# EAGLE design test_usb_hub (EAGLE 6.1)
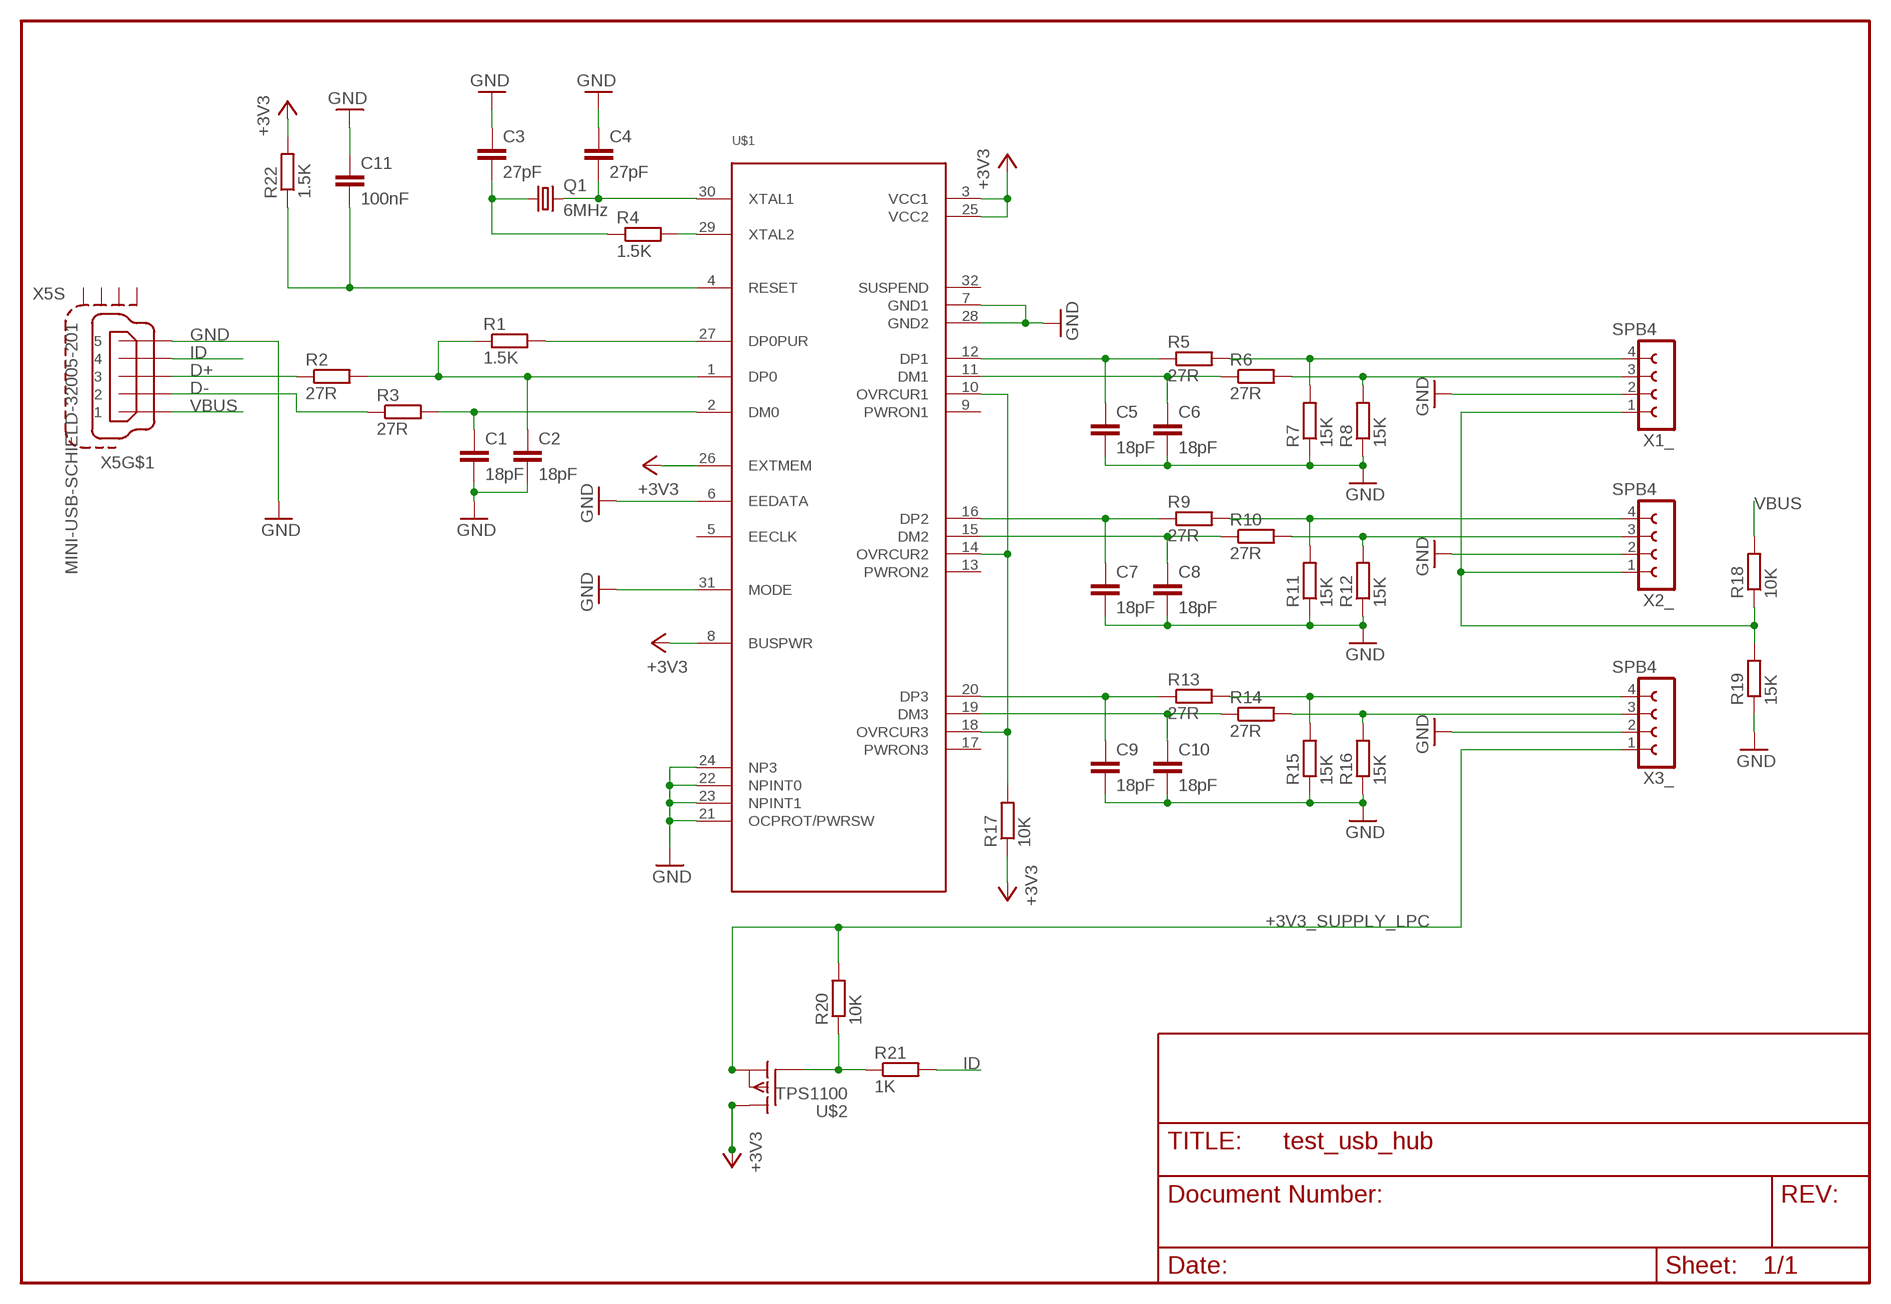
[diagram p0: schematic, sheet 1]

## Parts
C1  18pF  C-EUC1206  [C1206]
C2  18pF  C-EUC1206  [C1206]
C3  27pF  C-EUC1206  [C1206]
C4  27pF  C-EUC1206  [C1206]
C5  18pF  C-EUC1206  [C1206]
C6  18pF  C-EUC1206  [C1206]
C7  18pF  C-EUC1206  [C1206]
C8  18pF  C-EUC1206  [C1206]
C9  18pF  C-EUC1206  [C1206]
C10  18pF  C-EUC1206  [C1206]
C11  100nF  C-EUC1206  [C1206]
Q1  6MHz  CRYTALHC49U-V  [HC49U-V]
R1  1.5K  R-EU_R1206  [R1206]
R2  27R  R-EU_R1206  [R1206]
R3  27R  R-EU_R1206  [R1206]
R4  1.5K  R-EU_R1206  [R1206]
R5  27R  R-EU_R1206  [R1206]
R6  27R  R-EU_R1206  [R1206]
R7  15K  R-EU_R1206  [R1206]
R8  15K  R-EU_R1206  [R1206]
R9  27R  R-EU_R1206  [R1206]
R10  27R  R-EU_R1206  [R1206]
R11  15K  R-EU_R1206  [R1206]
R12  15K  R-EU_R1206  [R1206]
R13  27R  R-EU_R1206  [R1206]
R14  27R  R-EU_R1206  [R1206]
R15  15K  R-EU_R1206  [R1206]
R16  15K  R-EU_R1206  [R1206]
R17  10K  R-EU_R1206  [R1206]
R18  10K  R-EU_R1206  [R1206]
R19  15K  R-EU_R1206  [R1206]
R20  10K  R-EU_R1206  [R1206]
R21  1K  R-EU_R1206  [R1206]
R22  1.5K  R-EU_R1206  [R1206]
U$1  TUSB2036OK  [QFP-32]
U$2  TPS1100  [SOIC8]
X1_  SPB4  [SPB4]
X2_  SPB4  [SPB4]
X3_  SPB4  [SPB4]
X5  MINI-USB-SCHIELD-32005-201  [32005-201]

## Nets
+3V3: R17.1 R22.2 U$1.3(VCC1) U$1.8(BUSPWR) U$1.25(VCC2) U$1.26(EXTMEM) U$2.5(D) U$2.6(D1) U$2.7(D2) U$2.8(D3)
+3V3_SUPPLY_LPC: R20.2 U$2.1(S) U$2.2(S1) U$2.3(S2) X3_.1
D+: R2.1 X5.3
D-: R3.1 X5.2
GND: C1.2 C2.2 C3.1 C4.1 C5.2 C6.2 C7.2 C8.2 C9.2 C10.2 C11.1 R7.1 R8.1 R11.1 R12.1 R15.1 R16.1 R19.1 U$1.6(EEDATA) U$1.7(GND1) U$1.21(OCPROT/PWRSW) U$1.22(NPINT0) U$1.23(NPINT1) U$1.24(NP3) U$1.28(GND2) U$1.31(MODE) X1_.2 X2_.2 X3_.2 X5.5
ID: R21.2 X5.4
N$1: C2.1 R1.1 R2.2 U$1.1(DP0)
N$2: C1.1 R3.2 U$1.2(DM0)
N$3: R1.2 U$1.27(DP0PUR)
N$5: R20.1 R21.1 U$2.4(G)
N$6: C4.2 Q1.2 U$1.30(XTAL1)
N$7: R4.2 U$1.29(XTAL2)
N$8: C3.2 Q1.1 R4.1
N$9: C5.1 R5.1 U$1.12(DP1)
N$10: R5.2 R7.2 X1_.4
N$11: R6.2 R8.2 X1_.3
N$12: C6.1 R6.1 U$1.11(DM1)
N$13: C7.1 R9.1 U$1.16(DP2)
N$14: R9.2 R11.2 X2_.4
N$15: R10.2 R12.2 X2_.3
N$16: C8.1 R10.1 U$1.15(DM2)
N$17: C9.1 R13.1 U$1.20(DP3)
N$18: R13.2 R15.2 X3_.4
N$19: R14.2 R16.2 X3_.3
N$20: C10.1 R14.1 U$1.19(DM3)
N$21: R17.2 U$1.10(OVRCUR1) U$1.14(OVRCUR2) U$1.18(OVRCUR3)
N$22: R18.1 R19.2 X1_.1 X2_.1
N$23: C11.2 R22.1 U$1.4(RESET)
VBUS: R18.2 X5.1
Unconnected: U$1.5(EECLK) U$1.9(PWRON1) U$1.13(PWRON2) U$1.17(PWRON3) U$1.32(SUSPEND) X5.M1(S:S1) X5.M2(S:S2) X5.M3(S:S3) X5.M4(S:S4)

## Library data of the parts
C1-C11 = rcl:C-EU: CAPACITOR, European symbol
Q1 = crystal:CRYTAL: CRYSTAL
R1-R22 = rcl:R-EU_: RESISTOR, European symbol
U$1 = paparazzi:TUSB2036
U$2 = paparazzi:TPS1100
X1_ X2_ X3_ = con-hirschmann:SPB4: CONNECTOR 4 pins
X5 = con-cypressindustries:MINI-USB-SCHIELD-: MINI USB-B Conector Source: www.cypressindustries.com

## Board
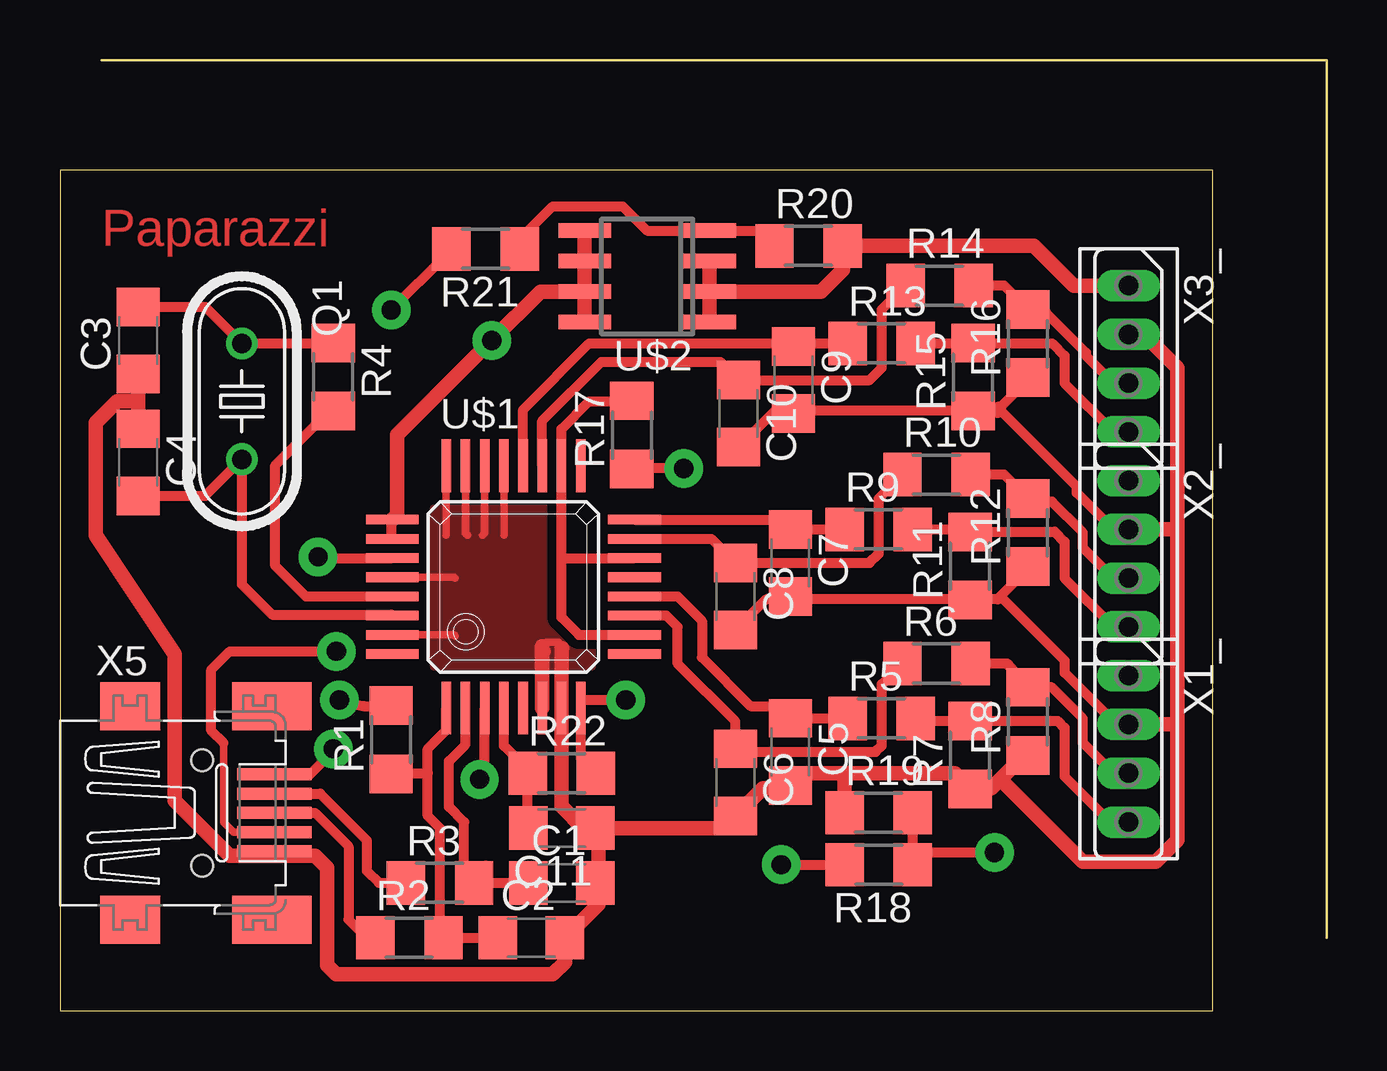
[diagram p1: board, top side]
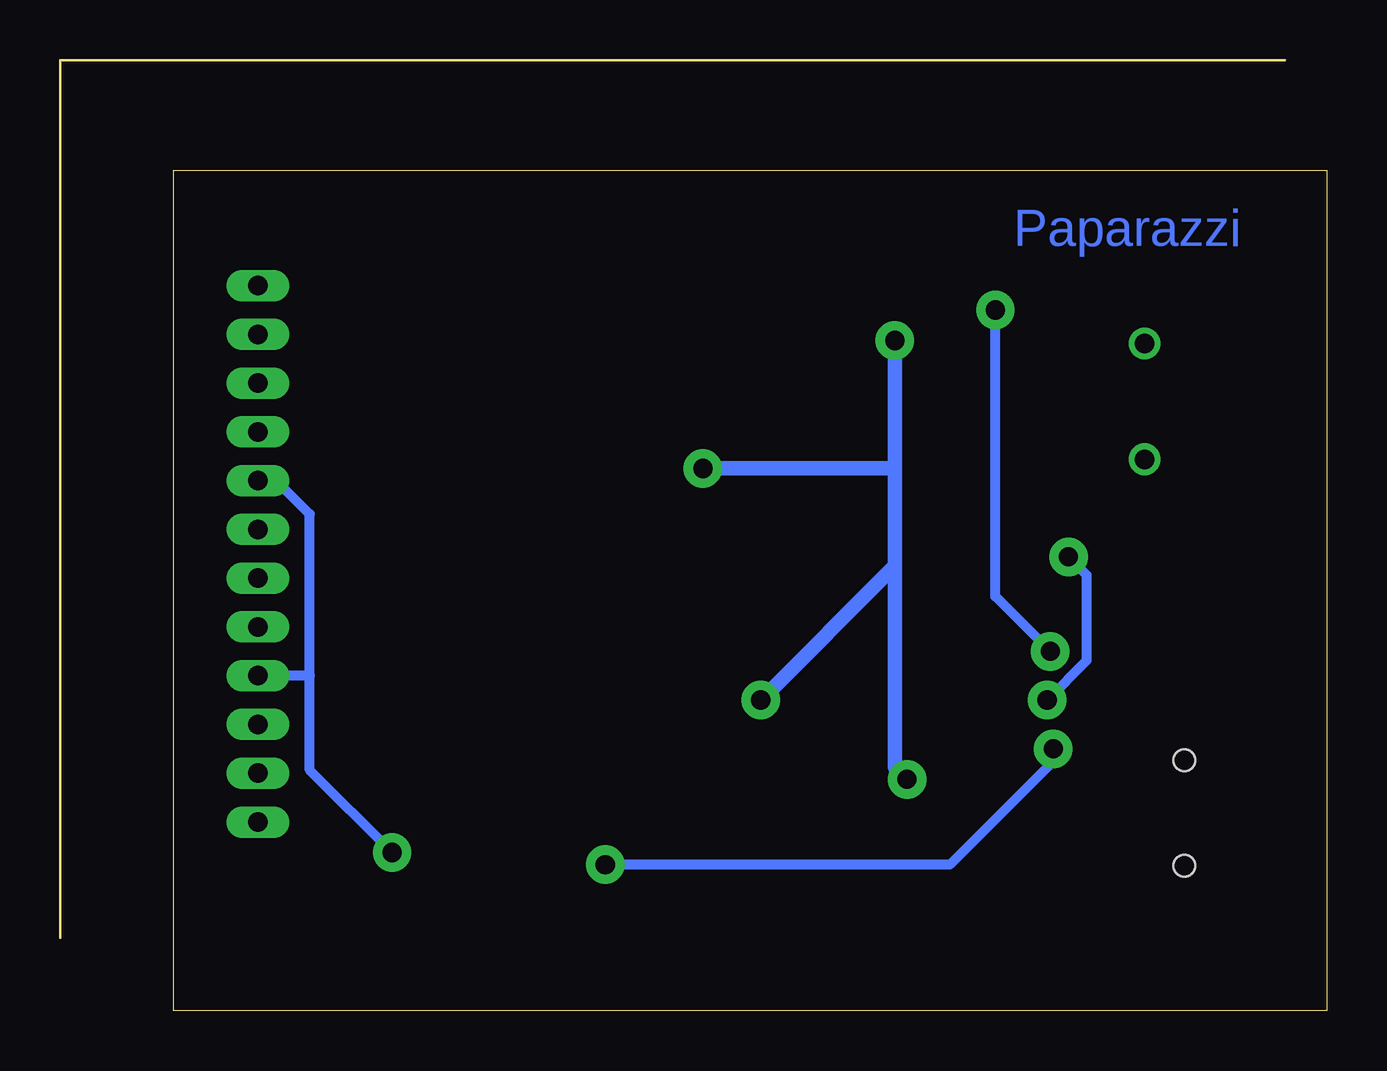
[diagram p2: board, bottom side, seen from below]

Size 52.79 x 39.62 mm. Coordinates in mm from the lower left corner, seen from the top.
Outline: 1.74,39.62 52.79,39.62 52.79,3.04
Outline: 48.06,0 48.06,35.03 0,35.03 0,0 48.06,0
Copper layers (1*16): Top 0.035mm / dielectric 1.5mm / Bottom 0.035mm
Design rules: minimum track width 10mil, minimum drill 24mil, track to track 8mil, track to pad 8mil, pad to pad 8mil, via to via 8mil, smd to smd 8mil, copper to edge 40mil, drill to drill 8mil, minimum pad ring 10mil, minimum via ring 8mil, stop-mask expansion 4mil, vias tented up to drill 0mil, thermal gap 10mil

### Footprints (pad centres in the part's own frame; a part is rotated, then mirrored left to right if it is on the bottom)
C1206 = smd 1.6 x 1.8: 1 -1.4,0; 2 1.4,0
HC49U-V = drill 0.813: 1 -2.413,0; 2 2.413,0
R1206 = smd 1.6 x 1.803: 1 -1.422,0; 2 1.422,0
QFP-32 = smd 0.4 x 2.2: 1 -2.4,-4.65; 2 -1.6,-4.65; 3 -0.8,-4.65; 4 0,-4.65; 5 0.8,-4.65; 6 1.6,-4.65; 7 2.4,-4.65; 8 3.2,-4.65; 17 3.2,5.45; 18 2.4,5.45; 19 1.6,5.45; 20 0.8,5.45; 21 0,5.45; 22 -0.8,5.45; 23 -1.6,5.45; 24 -2.4,5.45 | smd 2.2 x 0.4: 9 5.45,-2.4; 10 5.45,-1.6; 11 5.45,-0.8; 12 5.45,0; 13 5.45,0.8; 14 5.45,1.6; 15 5.45,2.4; 16 5.45,3.2; 25 -4.65,3.2; 26 -4.65,2.4; 27 -4.65,1.6; 28 -4.65,0.8; 29 -4.65,0; 30 -4.65,-0.8; 31 -4.65,-1.6; 32 -4.65,-2.4
SOIC8 = smd 0.6 x 2.2: 1 -1.905,-2.6; 2 -0.635,-2.6; 3 0.635,-2.6; 4 1.905,-2.6; 5 1.905,2.6; 6 0.635,2.6; 7 -0.635,2.6; 8 -1.905,2.6
SPB4 = drill 0.813 long: 1 -3.048,0; 2 -1.016,0; 3 1.016,0; 4 3.048,0
32005-201 = smd 3.1 x 0.5: 1 3,1.6; 2 3,0.8; 3 3,0; 4 3,-0.8; 5 3,-1.6 | smd 2.5 x 2: M1 -3,-4.45; M2 -3,4.45 | smd 3.3 x 2: M3 2.9,4.45; M4 2.9,-4.45 | hole 0.9: 0,2.2; 0,-2.2

### Placement (x,y rotation side)
C1  20.92,5.33 0 top
C2  19.65,3.04 0 top
C3  3.26,27.94 90 top
C4  3.26,22.86 270 top
C5  30.44,10.79 270 top
C6  28.16,9.52 270 top
C7  30.44,18.66 270 top
C8  28.16,17.27 270 top
C9  30.57,26.28 270 top
C10  28.28,24.89 270 top
C11  20.92,7.61 180 top
Q1  7.58,25.39 270 top
R1  13.8,11.3 90 top
R2  14.57,3.04 0 top
R3  15.84,5.33 0 top
R4  11.39,26.41 270 top
R5  34.25,12.19 0 top
R6  36.54,14.47 0 top
R7  37.93,10.66 90 top
R8  40.35,12.06 90 top
R9  34.12,20.06 0 top
R10  36.54,22.35 0 top
R11  37.93,18.54 90 top
R12  40.35,19.93 90 top
R13  34.25,27.81 0 top
R14  36.66,30.22 0 top
R15  38.06,26.41 90 top
R16  40.35,27.81 90 top
R17  23.84,24 90 top
R18  34.12,6.09 180 top
R19  34.12,8.25 0 top
R20  31.2,31.87 0 top
R21  17.74,31.74 180 top
R22  20.92,9.9 0 top
U$1  18.5,17.27 0 top
U$2  24.47,30.6 90 top
X1_  44.54,10.92 270 top
X2_  44.54,19.05 270 top
X3_  44.54,27.17 270 top
X5  5.93,8.25 0 top

### Tracks (layer width: path | path; a pad name or v marks a point on that pad's centre or on a via)
+3V3  (via drill 0.8 pad 1.6)
  Top 0.406: R22.2 22.31,9.9 21.7,10.51 U$1.8 21.7,12.95 v23.58,12.95 | U$1.25 13.83,20.44 13.8,20.44 13.8,19.72 U$1.26 | U$1.3 17.7,9.86 v17.49,9.65 | R17.1 23.84,22.6 v26,22.6
  Top 0.61: U$2.5 21.87,31.3 21.93,31.24 U$2.6 21.87,30.03 21.81,29.97 | U$2.8 21.81,28.7 21.87,28.76 U$2.7 21.81,29.97 | 21.81,29.97 20.03,29.97 v18,27.94 14.06,24 14.06,20.57 13.96,20.57 U$1.25
  Bottom 0.61: 18,18.54 18,22.6 | 18,22.6 v18,27.94 | 18,18.54 v23.58,12.95 | 18,22.6 v26,22.6 | v17.49,9.65 18,10.16 18,18.54
+3V3_SUPPLY_LPC
  Top 0.61: U$2.1 U$2.2 | U$2.2 27.07,30.03 27.14,30.09 | U$2.2 27.14,29.97 27.07,30.03 U$2.3 27.01,31.24 | R20.2 32.6,31.87 | R20.2 32.63,30.88 31.71,29.97 U$2.2 | U$2.2 27.01,29.97 | R20.2 40.6,31.87 42.25,30.22 X3_.1
D+
  Top 0.406: X5.3 10.63,8.25 12.03,6.85 12.03,3.81 12.79,3.04 R2.1 | R2.1 13.04,3.04 | R2.1 13.17,3.04
D-
  Top 0.406: X5.2 10.85,9.05 12.79,7.11 12.79,5.84 13.3,5.33 R3.1
GND
  Top 0.305: 18.5,19.81 U$1.21 | U$1.22 17.7,19.9 17.62,19.81 | U$1.23 16.9,19.88 16.98,19.81 | U$1.24 16.1,19.82 16.09,19.81 | U$1.28 16.43,18.07 16.47,18.03 | U$1.31 16.42,15.67 16.47,15.62 | 20.1,15.18 20.28,15.36 20.79,15.36 20.9,14.74
  Top 0.406: C8.2 29.43,17.14 30.44,17.14 37.96,17.14 39.08,17.14 39.2,17.27 | C10.2 29.81,25.01 30.57,25.01 38.09,25.01 39.08,25.01 | 39.2,17.27 40.45,18.51 | 40.45,26.39 39.14,25.08 42.38,21.84 42.38,21.59 43.9,20.06 X2_.2 | 39.2,17.27 41.88,14.59 41.88,14.08 44.03,11.93 X1_.2 | X5.5 8.85,6.57 8.85,6.47 | C11.1 21.81,7.61
  Top 0.61: 37.96,17.14 R11.1 | 30.44,17.14 C7.2 | C6.2 29.3,9.27 30.44,9.27 | 30.44,9.27 C5.2 | 38.09,25.01 R15.1 | 30.57,25.01 C9.2 | R8.1 40.35,10.79 39.2,9.65 | 39.2,9.65 38.82,9.27 37.96,9.27 R7.1 37.93,9.27 37.3,9.9 32.73,9.9 | 40.47,18.54 40.45,18.51 R12.1 | 39.14,25.08 39.08,25.01 | 22.44,5.46 C1.2 | 22.44,5.46 22.44,4.44 C2.2 21.04,2.03 20.54,1.52 11.52,1.52 11.14,1.9 11.14,5.96 10.63,6.47 8.85,6.47 7.07,6.47 4.79,8.76 4.79,14.85 1.49,19.81 1.49,24.51 2.38,25.39 3.26,25.39 | C6.2 | C4.1 | 3.26,25.39 C4.1 | 3.26,25.39 C3.1 | 3.14,24.25 C4.1 | 30.44,9.27 31.08,9.9 32.73,9.9 | 32.73,9.9 32.73,9.77 32.7,9.75 R19.1 | 46.57,11.93 46.57,7.11 45.68,6.22 42.63,6.22 39.2,9.65 | 46.57,11.93 46.57,20.06 | 46.57,11.93 X1_.2 | 46.57,20.06 X2_.2 | C1.2 22.19,5.33 | C1.2 22.7,5.33 | 46.57,20.06 46.57,26.79 45.17,28.19 X3_.2 | 21.81,7.61 20.9,8.52 U$1.7 20.9,14.74 20.9,15.11 20.92,15.11 | C6.2 27.65,7.61 C11.1 | C11.1 | 20.1,15.18 20.1,14.98 | 20.1,14.98 U$1.6 | 20.1,14.98 20.16,14.98 | C11.1 22.32,7.49 22.31,7.49 22.44,7.36 22.44,5.46 | 40.45,26.39 40.47,26.41 40.37,26.41 R16.1 40.45,26.39
  pour Top (isolate 0.381, no thermals): 15.58,20.95 15.58,14.35 22.19,14.35 22.19,20.95
ID  (via drill 0.8 pad 1.6)
  Top 0.305: X5.4 7.24,7.45 6.82,7.87 6.82,11.17
  Top 0.406: 16.22,31.74 R21.2 16.09,31.74 16.09,31.49 v13.8,29.2 | 6.82,11.17 6.31,11.68 6.31,14.22 7.07,14.98 v11.52,14.98
  Bottom 0.406: v11.52,14.98 13.8,17.27 v13.8,29.2
N$1
  Top 0.406: 18.38,3.04 C2.1 R2.2 | R2.2 15.84,3.04 | R2.2 15.84,3.19 15.84,7.61 15.33,8.12 15.33,9.9 | 15.33,9.9 15.33,10.92 16.1,11.69 U$1.1 | R1.1 15.3,9.88 15.33,9.9
N$2
  Top 0.406: 19.65,5.58 C1.1 17.36,5.33 | R3.2 17.74,6.07 | 17.36,5.33 17.62,5.33 | R3.2 17.36,5.33 | 16.85,5.33 16.73,5.33 | U$1.2 16.9,11.1 16.22,10.41 16.22,8.5 16.85,7.87 16.85,5.33 | R3.2 16.85,5.33
N$3  (via drill 0.8 pad 1.6)
  Top 0.406: U$1.27 10.81,18.87 v10.76,18.92 | R1.2 13.8,12.7 12.66,12.7 v11.65,12.95
  Bottom 0.406: v11.65,12.95 10,14.6 10,18.16 v10.76,18.92
N$5
  Top 0.406: R20.1 29.68,31.87 29.04,32.51 U$2.4 24.47,32.51 23.46,33.52 20.54,33.52 18.89,31.87 R21.1
N$6
  Top 0.406: C4.2 6.06,21.46 Q1.2 | Q1.2 7.46,22.98 | U$1.30 13.82,16.5 8.85,16.5 7.58,17.78 Q1.2
N$7
  Top 0.406: R4.2 11.39,25.01 | R4.2 11.37,25.01 | U$1.29 10.25,17.27 8.98,18.54 8.98,22.73 11.39,25.14 R4.2
N$8
  Top 0.406: C3.2 6.06,29.34 Q1.1 11.37,27.81 R4.1
N$9
  Top 0.305: C5.1
  Top 0.406: R5.1 C5.1 30.32,12.19 C5.1 30.44,12.7 28.79,12.7 26.76,14.73 26.76,16.25 25.74,17.27 U$1.12
N$10
  Top 0.406: 37.83,12.09 37.81,12.06 | R7.2 37.83,12.09 | 37.83,12.09 37.84,12.09 | R5.2 35.78,12.19 35.88,12.09 R7.2 | R7.2 41.59,12.09 41.87,11.81 41.87,9.77 43.78,7.87 X1_.4
N$11
  Top 0.406: 37.93,14.47 R6.2 39.48,14.47 R8.2 41.34,13.48 42.63,12.19 42.63,11.17 43.9,9.9 X1_.3
N$12
  Top 0.406: R6.1 34.25,13.61 34.25,11.04 34,10.79 28.03,10.79 C6.1 | C6.1 | C6.1 28.16,12.06 25.74,14.47 25.74,16 25.27,16.47 U$1.11
N$13
  Top 0.254: 30.32,20.06 C7.1
  Top 0.406: C7.1 R9.1 | C7.1 | U$1.16 30.04,20.47 C7.1
N$14
  Top 0.406: R9.2 37.83,20.06 R11.2 37.93,19.93 37.96,19.96 41.46,19.96 41.87,19.55 41.87,18.03 43.9,16 X2_.4
N$15
  Top 0.406: 40.32,21.36 40.22,21.46 | 40.32,21.36 R12.2 39.36,22.35 R10.2 37.93,22.35 | 40.32,21.36 40.46,21.21 41.35,21.21 42.63,19.93 42.63,19.3 43.9,18.03 X2_.3
N$16
  Top 0.406: R10.1 34.12,21.36 34.12,19.05 33.74,18.66 C8.1 | C8.1 | U$1.15 27.15,19.67 C8.1
N$17
  Top 0.305: 30.44,27.68 30.45,27.68 C9.1
  Top 0.406: R13.1 30.69,27.81 C9.1 30.44,27.81 22.06,27.81 19.3,25.05 U$1.20
N$18
  Top 0.406: 38.06,27.81 R15.2 38.04,27.81 R13.2 35.65,27.81 | 38.06,27.81 38.09,27.84 | 38.06,27.81 41.36,27.81 41.87,27.3 41.87,26.16 43.9,24.12 X3_.4 44.67,24.12
N$19
  Top 0.406: 38.06,30.22 R14.2 39.36,30.22 R16.2 40.35,29.2 40.46,29.09 41.1,29.09 42.76,27.43 42.76,27.3 43.9,26.16 X3_.3
N$20
  Top 0.406: R14.1 34.25,29.23 34.25,26.79 33.74,26.28 C10.1 | C10.1 | C10.1 27.52,27.05 22.57,27.05 20.1,24.58 U$1.19
N$21
  Top 0.406: 23.71,25.52 23.81,25.42 R17.2 23.74,25.42 23.71,25.39 22.06,25.39 20.9,24.24 U$1.18 20.9,18.79 | 20.9,18.79 20.9,16.39 21.63,15.67 U$1.10 | 20.9,18.79 20.92,18.79 20.99,18.87 U$1.14
N$22  (via drill 0.8 pad 1.6)
  Top 0.406: R19.2 35.52,8.25 35.55,8.23 35.55,6.6 | R18.1 35.55,6.6 | 35.55,6.6 v38.95,6.6
  Bottom 0.406: X2_.1 43.78,22.09 42.38,20.7 42.38,13.96 | 42.38,13.96 42.38,10.03 v38.95,6.6 | 42.38,13.96 X1_.1
N$23
  Top 0.406: U$1.4 18.5,11.04 19.52,10.03 19.5,10 R22.1 19.5,7.77 19.52,7.74 C11.2
VBUS  (via drill 0.8 pad 1.6)
  Top 0.406: X5.1 10.43,9.85 11.39,10.82 v11.39,10.92 | 32.73,6.09 R18.2 v30.06,6.09
  Bottom 0.406: v11.39,10.92 11.39,10.41 15.71,6.09 v30.06,6.09

### Text on the board
Top: Paparazzi
Bottom: Paparazzi